# EAGLE design ref_board (EAGLE 7.7.0)
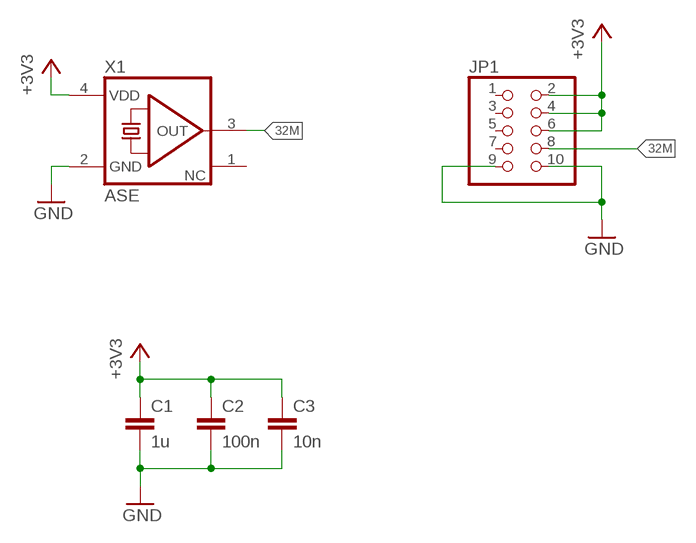
[diagram p0: schematic, sheet 1]

## Parts
C1  1u  C-EUC1206  [C1206]
C2  100n  C-EUC0805  [C0805]
C3  10n  C-EUC0805  [C0805]
JP1  PINHD-2X5/90  [2X05/90]
X1  ASE  [ASE]

## Nets
32M: JP1.8 X1.3(OUT)
+3V3: C1.1 C2.1 C3.1 JP1.2 JP1.4 JP1.6 X1.4(VDD)
GND: C1.2 C2.2 C3.2 JP1.9 JP1.10 X1.2(GND)
Unconnected: JP1.1 JP1.3 JP1.5 JP1.7 X1.1(NC)

## Library data of the parts
C1-C3 = rcl:C-EU: CAPACITOR, European symbol
JP1 = pinhead:PINHD-2X5: PIN HEADER
X1 = ILSI_tcxo:ASE: 2.5 mm x 3.2 mm Ceramic Package SMD TCXO ILSI I547-2P3-32.0000MHz; OC_FARNELL: unknown; OC_NEWARK: unknown

## Board
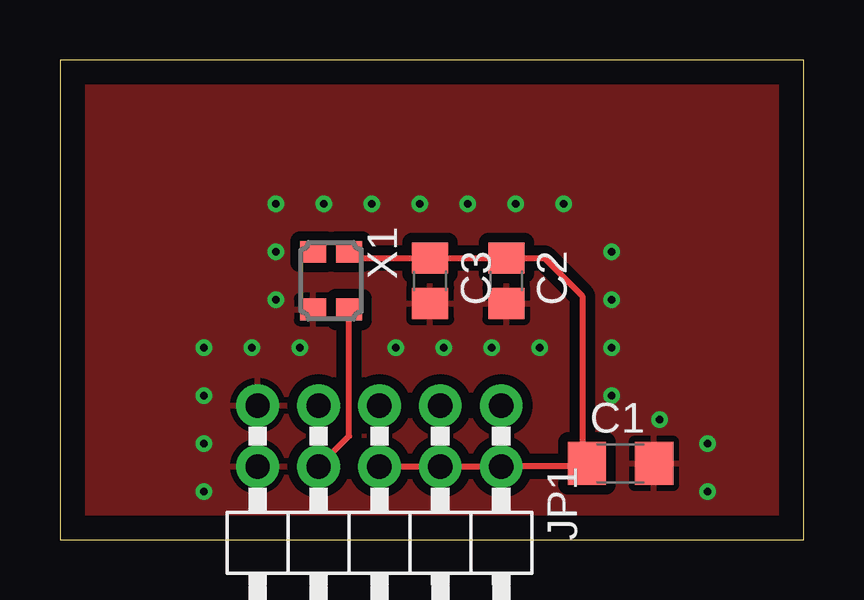
[diagram p1: board, top side]
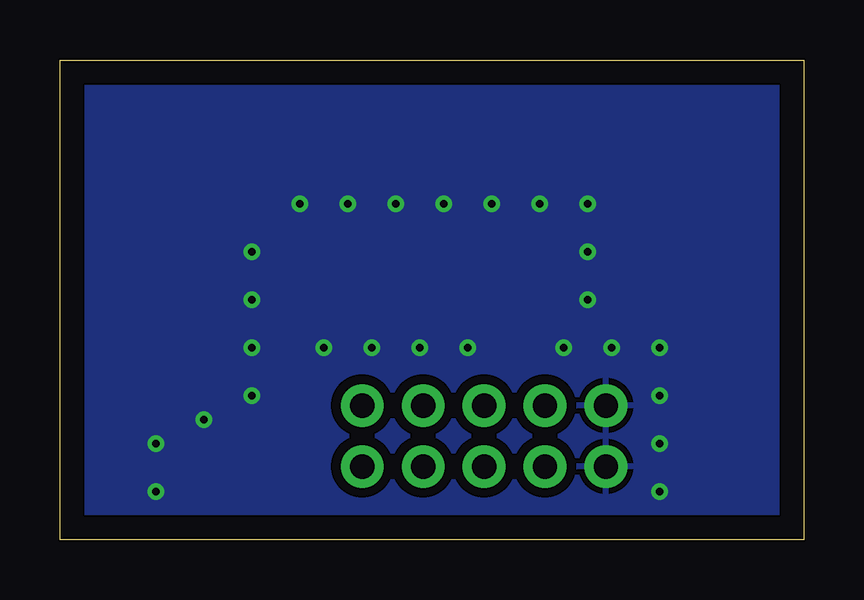
[diagram p2: board, bottom side, seen from below]

Size 31 x 20 mm. Coordinates in mm from the lower left corner, seen from the top.
Outline: 0,0 31,0 31,20 0,20 0,0
Copper layers (1*16): Top 0.035mm / dielectric 1.5mm / Bottom 0.035mm
Design rules "default *": minimum track width 10mil, minimum drill 24mil, track to track 8mil, track to pad 8mil, pad to pad 8mil, via to via 8mil, smd to smd 8mil, copper to edge 40mil, drill to drill 8mil, minimum pad ring 10mil, minimum via ring 8mil, stop-mask expansion 4mil, vias tented up to drill 0.3mm, thermal gap 10mil

### Footprints (pad centres in the part's own frame; a part is rotated, then mirrored left to right if it is on the bottom)
C1206 = smd 1.6 x 1.8: 1 -1.4,0; 2 1.4,0
C0805 = smd 1.3 x 1.5: 1 -0.95,0; 2 0.95,0
2X05/90 = drill 1.016 pad 1.778: 1 -5.08,-6.35; 2 -5.08,-3.81; 3 -2.54,-6.35; 4 -2.54,-3.81; 5 0,-6.35; 6 0,-3.81; 7 2.54,-6.35; 8 2.54,-3.81; 9 5.08,-6.35; 10 5.08,-3.81
ASE = smd 0.9 x 1.1: 1 -1.2,-0.75; 2 1.2,-0.75; 3 1.2,0.75; 4 -1.2,0.75

### Placement (x,y rotation side)
C1  23.37,3.17 0 top
C2  18.61,10.79 270 top
C3  15.43,10.79 270 top
JP1  13.32,-0.76 180 top
X1  11.3,10.79 270 top

### Tracks (layer width: path | path; a pad name or v marks a point on that pad's centre or on a via)
32M
  Top 0.254: JP1.8 12.05,4.32 X1.3
+3V3
  Top 0.254: X1.4 12.3,11.74 C3.1 C2.1 20.19,11.75 21.78,10.16 21.78,3.05 | JP1.6 JP1.4 JP1.2 21.78,3.05 | C1.1 21.84,3.05 21.78,3.05
GND  (via drill 0.3)
  other vias: 6,2 6,4 6,6 6,8 8,8 10,8 9,10 9,12 9,14 11,14 13,14 15,14 17,14 19,14 21,14 23,12 23,10 23,8 23,6 25,5 14,8 16,8 18,8 20,8 27,4 27,2
  pour Bottom (isolate 0.406): 0,20 31,20 31,0 0,0
  pour Top (isolate 0.406): 0,20 31,20 31,0 0,0

### Text on the board
tDocu: REP_REF_BOARD_1.0